# EAGLE design board1 (EAGLE 9.4.0)
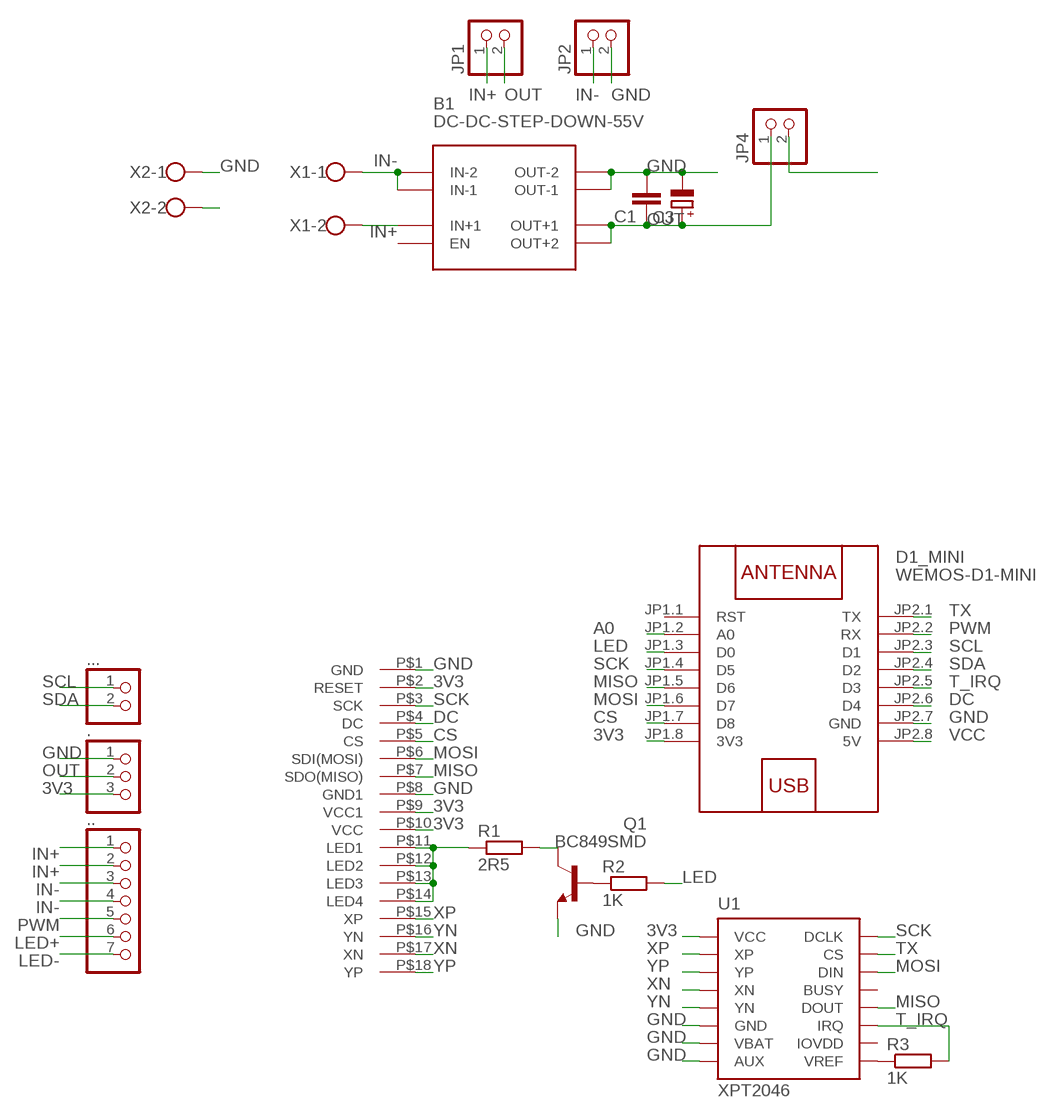
[diagram p0: schematic, sheet 1]

## Parts
.  PINHD-1X3  [1X03]
..  PINHD-1X7  [1X07]
...  PINHD-1X2  [1X02]
B1  DC-DC-STEP-DOWN-55V  [DC-DC-STEP-DOWN-55V]
C1  C-EUC0805  [C0805]
C3  CPOL-EUE2-5  [E2-5]
D1_MINI  WEMOS-D1-MINI  [WEMOS-D1-MINI]
JP1  PINHD-1X2  [1X02]
JP2  PINHD-1X2  [1X02]
JP4  PINHD-1X2  [1X02]
Q1  BC849SMD  [SOT23-BEC]
R1  2R5  R-EU_R1210W  [R1210W]
R2  1K  R-EU_R1210W  [R1210W]
R3  1K  R-EU_R1210W  [R1210W]
U1  XPT2046  [TSSOP16]
U$2  2.4TTF  [TFT2.4]
X1  W237-102  [W237-102]
X2  W237-102  [W237-102]

## Nets
3V3: ..3 D1_MINI.JP1.8(3V3) U1.1(VCC) U$2.P$2(RESET) U$2.P$9(VCC1) U$2.P$10(VCC)
A0: D1_MINI.JP1.2(A0) X2.2
CS: D1_MINI.JP1.7(D8) U$2.P$5(CS)
DC: D1_MINI.JP2.6(D4) U$2.P$4(DC)
GND: ..1 B1.VOUT-1(OUT-1) B1.VOUT-2(OUT-2) C1.2 C3.- D1_MINI.JP2.7(GND) JP2.2 Q1.E U1.6(GND) U1.7(VBAT) U1.8(AUX) U$2.P$1(GND) U$2.P$8(GND1) X2.1
IN+: ...1 ...2 B1.VIN+(IN+1) JP1.1 X1.2
IN-: ...3 ...4 B1.VIN-1(IN-1) B1.VIN-2(IN-2) JP2.1 X1.1
LED: D1_MINI.JP1.3(D0) R2.2
LED+: ...6
LED-: ...7
MISO: D1_MINI.JP1.5(D6) U1.12(DOUT) U$2.P$7(SDO(MISO))
MOSI: D1_MINI.JP1.6(D7) U1.14(DIN) U$2.P$6(SDI(MOSI))
N$2: R1.1 U$2.P$11(LED1) U$2.P$12(LED2) U$2.P$13(LED3) U$2.P$14(LED4)
N$3: Q1.C R1.2
N$4: Q1.B R2.1
N$5: R3.1 U1.9(VREF)
OUT: ..2 B1.VOUT+1(OUT+1) B1.VOUT+2(OUT+2) C1.1 C3.+ JP1.2 JP4.1
PWM: ...5 D1_MINI.JP2.2(RX)
SCK: D1_MINI.JP1.4(D5) U1.16(DCLK) U$2.P$3(SCK)
SCL: ....1 D1_MINI.JP2.3(D1)
SDA: ....2 D1_MINI.JP2.4(D2)
T_IRQ: D1_MINI.JP2.5(D3) R3.2 U1.11(IRQ)
TX: D1_MINI.JP2.1(TX) U1.15(CS)
VCC: D1_MINI.JP2.8(5V) JP4.2
XN: U1.4(XN) U$2.P$17(XN)
XP: U1.2(XP) U$2.P$15(XP)
YN: U1.5(YN) U$2.P$16(YN)
YP: U1.3(YP) U$2.P$18(YP)
Unconnected: B1.EN D1_MINI.JP1.1(RST) U1.10(IOVDD) U1.13(BUSY)

## Library data of the parts
. = pinhead:PINHD-1X3: PIN HEADER
.. = pinhead:PINHD-1X7: PIN HEADER
... JP1 JP2 JP4 = pinhead:PINHD-1X2: PIN HEADER
B1 = diy-modules:DC-DC-STEP-DOWN-55V
C1 = rcl:C-EU: CAPACITOR, European symbol; SPICEPREFIX: C
C3 = rcl:CPOL-EU: POLARIZED CAPACITOR, European symbol; SPICEPREFIX: C
D1_MINI = diy-modules:WEMOS-D1-MINI: WEMOS D1 mini: Mini Wi-Fi Board based on ESP-8266 device More details can be found here: https://www.wemos.cc/product/d1-mini.html Click here to find device on ebay.com <http://www.ebay.com/sch/wemos+d1+mini+nodemcu>
Q1 = transistor-npn:BC849*: NPN Transistor
R1-R3 = rcl:R-EU_: RESISTOR, European symbol; SPICEPREFIX: R
U1 = eagle1:XPT2046
U$2 = eagle1:2.4TTF
X1 X2 = con-wago-500:W237-102: WAGO SCREW CLAMP; MPN: 237-102; OC_FARNELL: unknown; OC_NEWARK: 70K9898

## Net classes
0 default: width 0.406 mm, drill 0.406 mm, clearance 0.406 mm

## Board
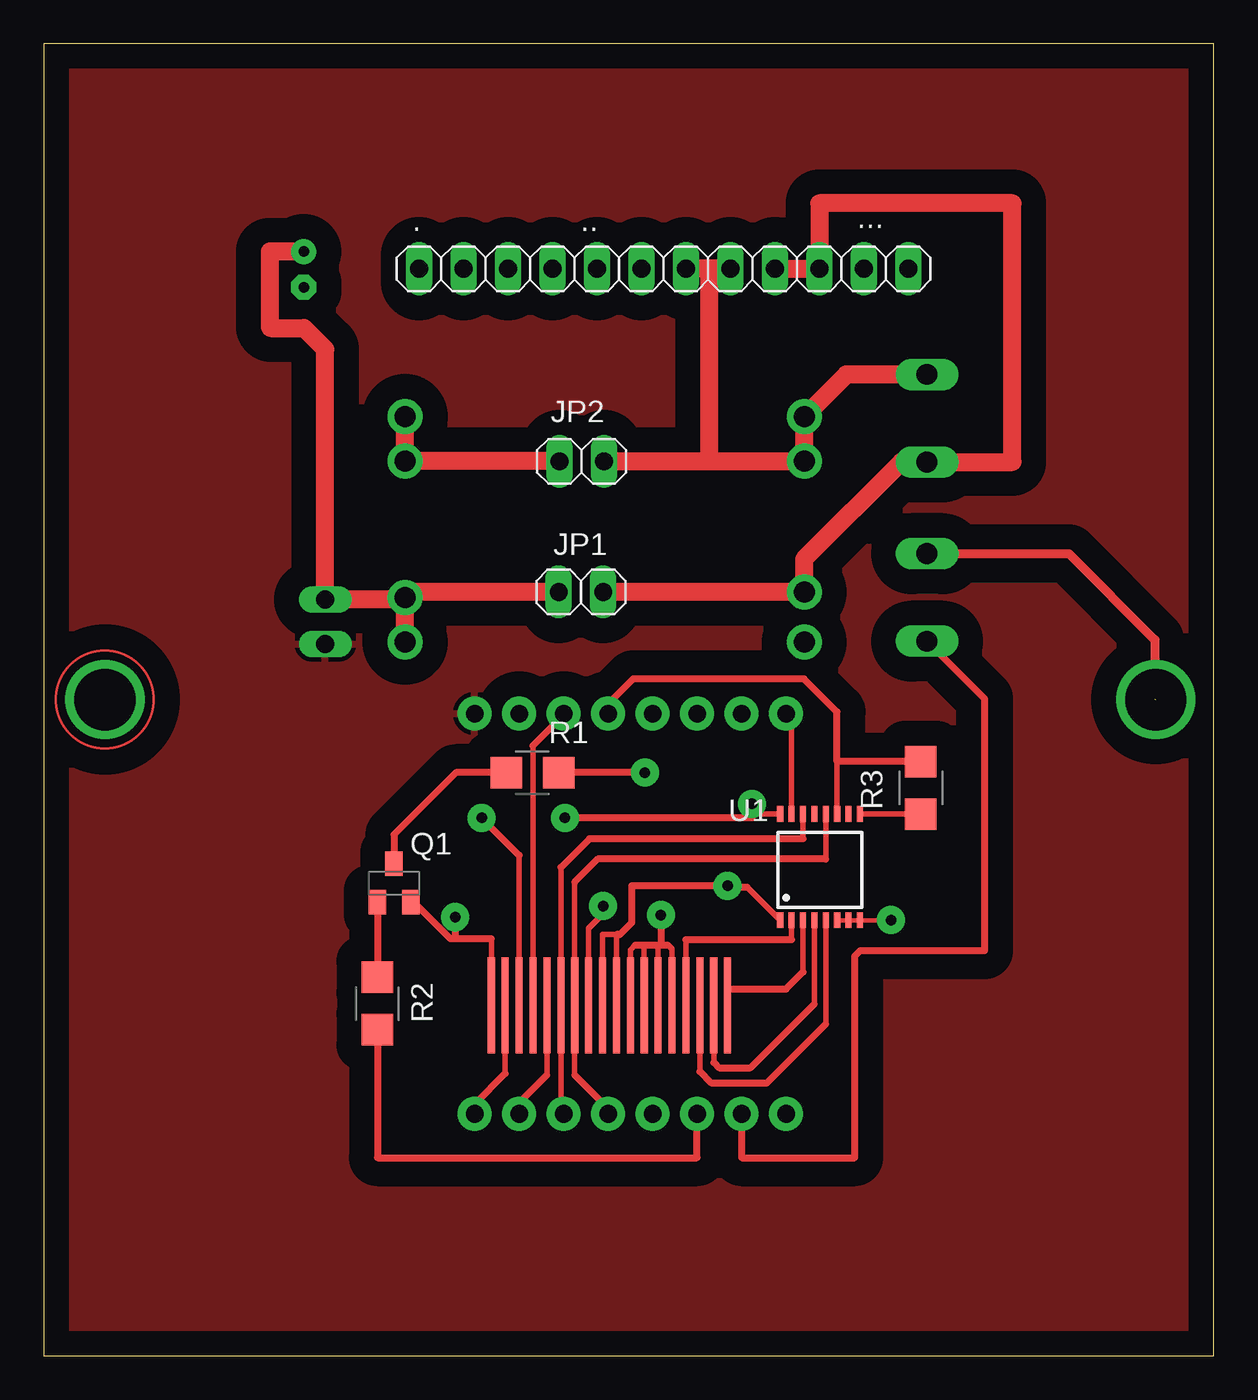
[diagram p1: board, top side]
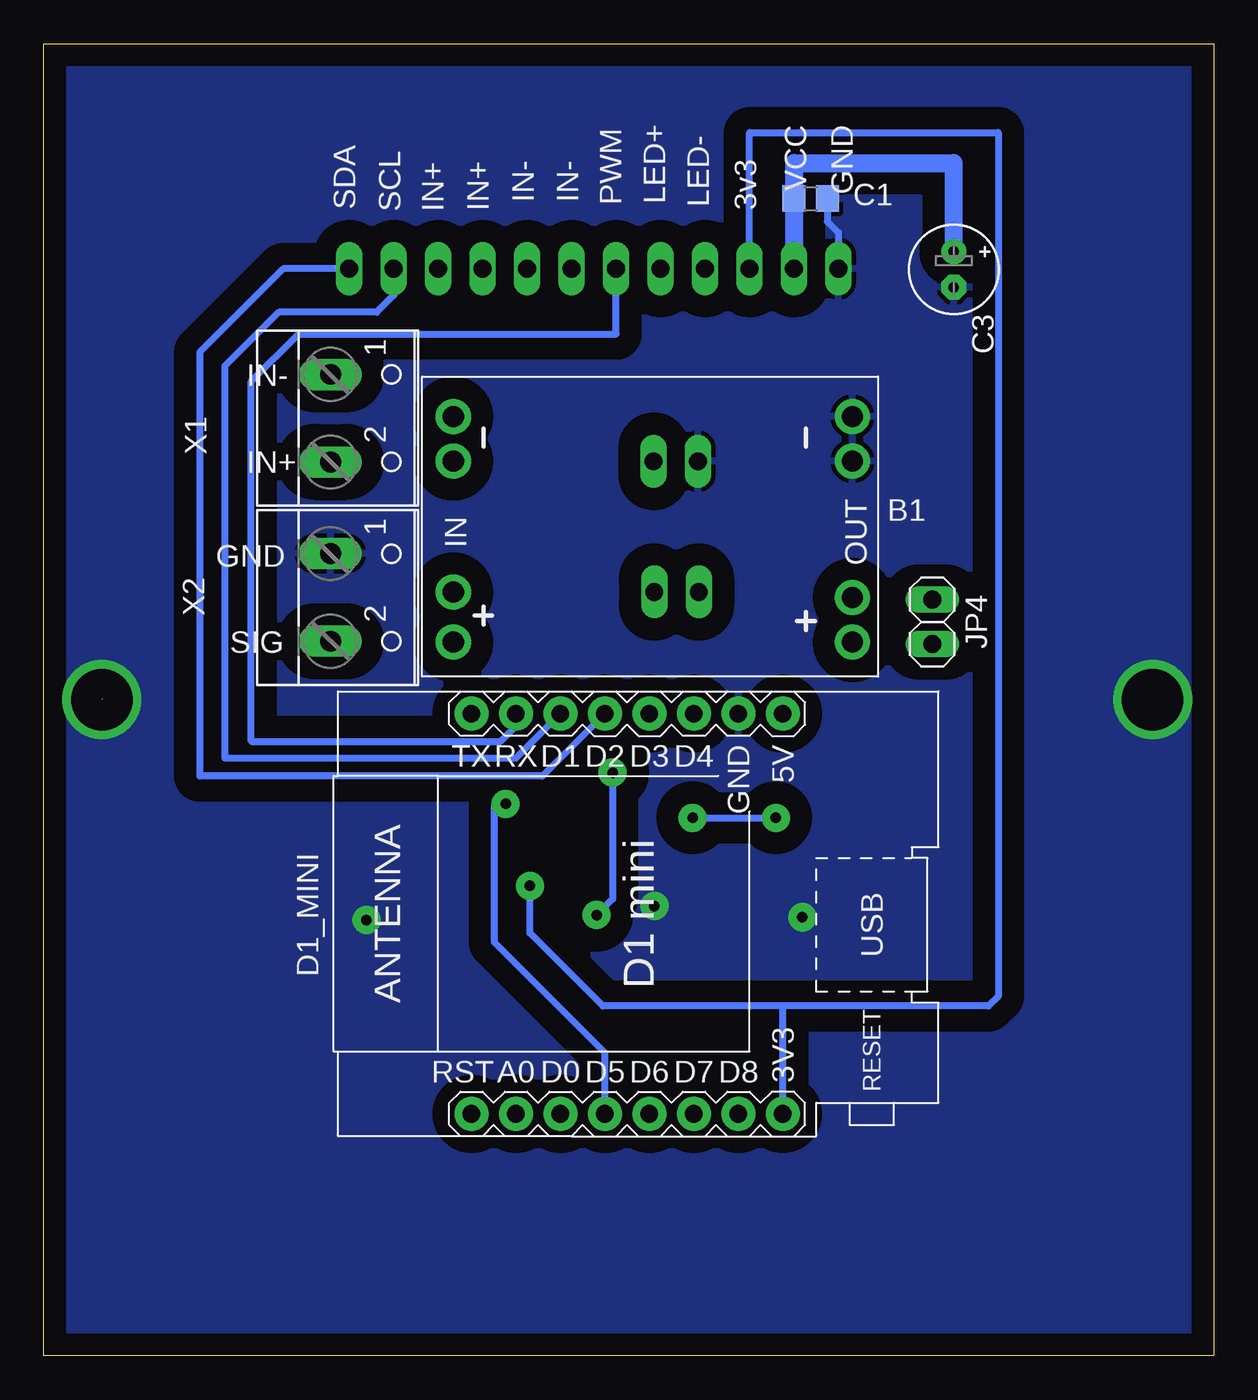
[diagram p2: board, bottom side, seen from below]

Size 66.81 x 74.92 mm. Coordinates in mm from the lower left corner, seen from the top.
Outline: 0,0 66.81,0 66.81,74.92 0,74.92 0,0
Copper layers (1*16): Top 0.035mm / dielectric 1.5mm / Bottom 0.035mm
Design rules "default *": minimum track width 2mil, minimum drill 0.6mm, track to track 8mil, track to pad 0.3mm, pad to pad 0.3mm, via to via 2mil, smd to smd 0.3mm, copper to edge 40mil, drill to drill 6mil, minimum pad ring 10mil, minimum via ring 8mil, stop-mask expansion 2mil, vias tented up to drill 0mil, thermal gap 10mil

### Footprints (pad centres in the part's own frame; a part is rotated, then mirrored left to right if it is on the bottom)
1X03 = drill 1.016 long: 1 -2.54,0; 2 0,0; 3 2.54,0
1X07 = drill 1.016 long: 1 -7.62,0; 2 -5.08,0; 3 -2.54,0; 4 0,0; 5 2.54,0; 6 5.08,0; 7 7.62,0
1X02 = drill 1.016 long: 1 -1.27,0; 2 1.27,0
DC-DC-STEP-DOWN-55V = drill 1.2 pad 2: EN 15.367,9.461; VIN+ 15.367,6.604; VIN-1 15.367,-3.429; VIN-2 15.367,-0.889; VOUT+1 -7.429,6.921; VOUT+2 -7.429,9.461; VOUT-1 -7.429,-3.429; VOUT-2 -7.429,-0.889
C0805 = smd 1.3 x 1.5: 1 -0.95,0; 2 0.95,0
E2-5 = drill 0.6 pad 1.422: + -1.016,0 | drill 0.6 pad 1.422 octagon: - 1.016,0
WEMOS-D1-MINI = drill 1 pad 1.93: JP1.1 -11.43,9.525; JP1.2 -11.43,6.985; JP1.3 -11.43,4.445; JP1.4 -11.43,1.905; JP1.5 -11.43,-0.635; JP1.6 -11.43,-3.175; JP1.7 -11.43,-5.715; JP1.8 -11.43,-8.255; JP2.1 11.43,9.525; JP2.2 11.43,6.985; JP2.3 11.43,4.445; JP2.4 11.43,1.905; JP2.5 11.43,-0.635; JP2.6 11.43,-3.175; JP2.7 11.43,-5.715; JP2.8 11.43,-8.255
SOT23-BEC = smd 1 x 1.4: B -0.95,-1.1; C 0,1.1; E 0.95,-1.1
R1210W = smd 1.8 x 1.8: 1 -1.499,0; 2 1.499,0
TSSOP16 = smd 0.9 x 0.35: 1 -2.875,2.275; 2 -2.875,1.625; 3 -2.875,0.975; 4 -2.875,0.325; 5 -2.875,-0.325; 6 -2.875,-0.975; 7 -2.875,-1.625; 8 -2.875,-2.275; 9 3.192,-2.275; 10 3.192,-1.625; 11 3.192,-0.975; 12 3.192,-0.325; 13 3.192,0.325; 14 3.192,0.975; 15 3.192,1.625; 16 3.192,2.275
TFT2.4 = smd 5.486 x 0.406: P$1 -0.873,0.238; P$2 -0.873,1.032; P$3 -0.873,1.826; P$4 -0.873,2.619; P$5 -0.873,3.413; P$6 -0.873,4.207; P$7 -0.873,5.001; P$8 -0.873,5.794; P$9 -0.873,6.588; P$10 -0.873,7.382; P$11 -0.873,8.176; P$12 -0.873,8.969; P$13 -0.873,9.763; P$14 -0.873,10.557; P$15 -0.873,11.351; P$16 -0.873,12.144; P$17 -0.873,12.938; P$18 -0.873,13.732
W237-102 = drill 1.194 long: 1 -2.5,-1.27; 2 2.5,-1.27

### Placement (x,y rotation side)
.  23.97,62.07 0 top
..  36.67,62.07 180 top
...  48.1,62.07 0 top
B1  28.06,50.2 180 bottom
C1  23.02,66.08 0 bottom
C3  14.84,62.03 270 bottom
D1_MINI  32.86,25.24 90 bottom
JP1  30.68,43.62 180 top
JP2  30.72,51.08 180 top
JP4  16.07,41.91 270 bottom
Q1  20,26.99 0 top
R1  27.9,33.3 180 top
R2  19.05,20.12 270 top
R3  50.09,32.42 90 top
U1  44.33,27.74 90 top
U$2  25.32,19.13 270 top
X1  49.17,53.54 270 bottom
X2  49.17,43.3 270 bottom

### Tracks (layer width: path | path; a pad name or v marks a point on that pad's centre or on a via)
3V3  (via drill 0.6 pad 1.6)
  Top 0.305: U$2.P$10 32.7,24.05 31.91,24.05 U$2.P$9 | U1.1 40.17,26.75 | U$2.P$2 26.35,16.11
  Top 0.406: D1_MINI.JP1.8 24.61,14.37 26.35,16.11 | 40.17,26.75 39.13,26.75 v39.05,26.83 33.58,26.83 33.58,24.73 32.9,24.05 32.7,24.05
  Bottom 0.406: ..3 26.51,69.85 12.3,69.85 12.3,20.52 12.86,19.96 24.61,19.96 | D1_MINI.JP1.8 24.61,19.96 | 39.05,26.87 v39.05,26.83 39.05,24.13 34.88,19.96 24.61,19.96
A0
  Top 0.406: D1_MINI.JP1.2 39.85,11.31 46.31,11.31 46.31,22.82 46.63,23.14 53.74,23.14 53.74,37.51 X2.2
CS
  Top 0.305: U$2.P$5 28.73,16.03
  Top 0.406: 28.73,16.03 27.15,14.45 D1_MINI.JP1.7
DC
  Top 0.305: 29.69,36.59 D1_MINI.JP2.6 | U$2.P$4 27.94,34.85
  Top 0.406: 27.94,34.85 29.69,36.59
GND  (via drill 0.6 pad 1.6, 3.5 pad 3)  (1 unrouted)
  Top 0.254: U1.6 U1.7 U1.8 48.36,24.87 v48.38,24.88
  Top 0.305: 25.56,23.82 U$2.P$1 | U$2.P$8 31.11,24.41 31.95,25.24 v31.95,25.68
  Top 0.406: Q1.E 21.14,25.89 23.21,23.82 23.5,23.82 | v23.5,25.04 23.5,23.82 | 23.5,23.82 25.56,23.82
  Top 0.508: X2.1 58.54,45.8 63.46,40.88 63.46,37.52
  Top 1.016: B1.VOUT-1 B1.VOUT-2 20.64,51.08 JP2.2
  Bottom 0.406: C1.2 22.07,64.77 21.43,64.14 ..1
  other vias: 3.49,37.47 63.5,37.47
  pour Bottom (isolate 1.27): -0.79,74.77 -0.79,-0.48 70.25,-0.48 70.25,74.77
IN+
  Top 1.016: B1.VIN+ 43.43,44.02 | ...2 ...1 44.29,65.8 55.32,65.8 55.32,51.04 X1.2 48.98,51.04 43.42,45.48 43.42,43.61 B1.VIN+ | B1.VIN+ 31.96,43.6 JP1.1
IN-
  Top 1.016: X1.1 45.83,56.04 B1.VIN-1 B1.VIN-2 43.38,51.05 43.36,51.08 38.02,51.08 | JP2.1 38.02,51.08 | ...3 37.98,62.07 | 37.98,62.07 ...4 | 37.98,62.07 37.98,51.12 38.02,51.08
LED
  Top 0.406: R2.2 19.05,11.31 37.31,11.31 D1_MINI.JP1.3
MISO
  Top 0.305: 30.32,16.03 U$2.P$7 30.32,27.05 | U1.12 44.66,28.36
  Top 0.406: D1_MINI.JP1.5 32.23,14.13 30.32,16.03 | 44.66,28.36 31.63,28.36 30.32,27.05
MOSI
  Top 0.305: 29.53,13.97 U$2.P$6 29.53,27.89 | U1.14 43.36,29.52
  Top 0.406: 29.53,13.97 D1_MINI.JP1.6 | 43.36,29.52 31.16,29.52 29.53,27.89
N$2  (via drill 0.6 pad 1.6)
  Top 0.305: U$2.P$11 33.5,23.18 33.77,23.46 | 35.64,23.46 35.88,23.22 U$2.P$14 | U$2.P$13 35.08,23.46 | U$2.P$12 34.29,23.46
  Top 0.406: v34.33,33.3 R1.1 | 33.77,23.46 34.29,23.46 35.08,23.46 35.28,23.46 | 35.28,23.46 35.64,23.46 | 35.28,23.46 35.24,23.5 v35.24,25.16
  Bottom 0.406: v34.33,33.3 34.33,26.07 v35.24,25.16 35.24,25.12
N$3
  Top 0.406: R1.2 23.54,33.3 20,29.77 Q1.C
N$4
  Top 0.406: Q1.B R2.1
N$5
  Top 0.305: U1.9 R3.1
  Top 0.406: R3.1
OUT
  Top 0.406: B1.VOUT+1 20.53,43.18
  Top 1.016: B1.VOUT+2 B1.VOUT+1 20.96,43.62 JP1.2 | 20.53,43.18 JP4.1 16.07,57.47 14.86,58.68 12.95,58.68 12.9,58.74 12.9,63.05 C3.+
  Bottom 0.406: C1.1
  Bottom 1.016: C1.1 ..2 | C1.1 23.97,68.1 14.86,68.1 14.86,63.06 C3.+
PWM
  Bottom 0.406: ...5 34.13,58.34 52.27,58.34 54.97,55.64 54.97,35.08 40.72,35.08 39.85,35.96 D1_MINI.JP2.2
SCK  (via drill 0.6 pad 1.6)
  Top 0.254: v29.77,30.72 29.73,30.72
  Top 0.305: 40.44,30.93 U1.16 | U$2.P$3 27.15,28.57
  Top 0.406: v29.77,30.72 40.44,30.72 v40.44,31.51 40.44,30.93 | 27.15,28.57 v25,30.72
  Bottom 0.406: v29.77,30.72 v25,30.72 | D1_MINI.JP1.4 34.77,17.3 41.08,23.61 41.08,31.43 40.44,31.43 v40.44,31.51
SCL
  Bottom 0.406: D1_MINI.JP2.3 39.85,34.13 56.48,34.13 56.48,56.52 53.4,59.59 47.8,59.59 46.83,60.56 ....1
SDA
  Bottom 0.406: ....2 53.14,62.07 57.9,57.31 57.9,33.1 38.34,33.1 D1_MINI.JP2.4
T_IRQ
  Top 0.305: U1.11 45.31,33.93
  Top 0.406: D1_MINI.JP2.5 32.23,37.23 33.66,38.66 43.42,38.66 45.31,36.77 45.31,33.93 45.31,33.92 R3.2
TX
  Top 0.305: D1_MINI.JP2.1 42.7,36.35 U1.15
VCC
  pour Top (isolate 1.422): 0.16,76.04 69.45,76.04 69.45,-0.79 0.16,-0.79
XN
  Top 0.305: U1.4 44.01,20.08 | U$2.P$17 38.26,16.75
  Top 0.406: 44.01,20.08 40.36,16.44 38.57,16.44 38.26,16.75
XP
  Top 0.305: U$2.P$15 36.67,23.77 | U1.2 42.71,23.77
  Top 0.406: 36.67,23.77 42.71,23.77
YN
  Top 0.305: U$2.P$16 37.47,16.23 | U1.5 44.66,18.94
  Top 0.406: 37.47,16.23 38.14,15.56 41.27,15.56 44.66,18.94
YP
  Top 0.305: U1.3 43.36,21.91
  Top 0.406: U$2.P$18 39.05,20.94 42.39,20.94 43.36,21.91
(copper drawn outside any net)
  shapes: Top circle x1

### Text on the board
bNames: GND | VCC | LED- | LED+ | PWM | SCL | SDA | 3v3 | IN- | IN- | IN+ | IN+ | IN- | IN+ | GND | SIG